# EAGLE design ft231x-breakout-v11-openSX70version (EAGLE 8.5.1)
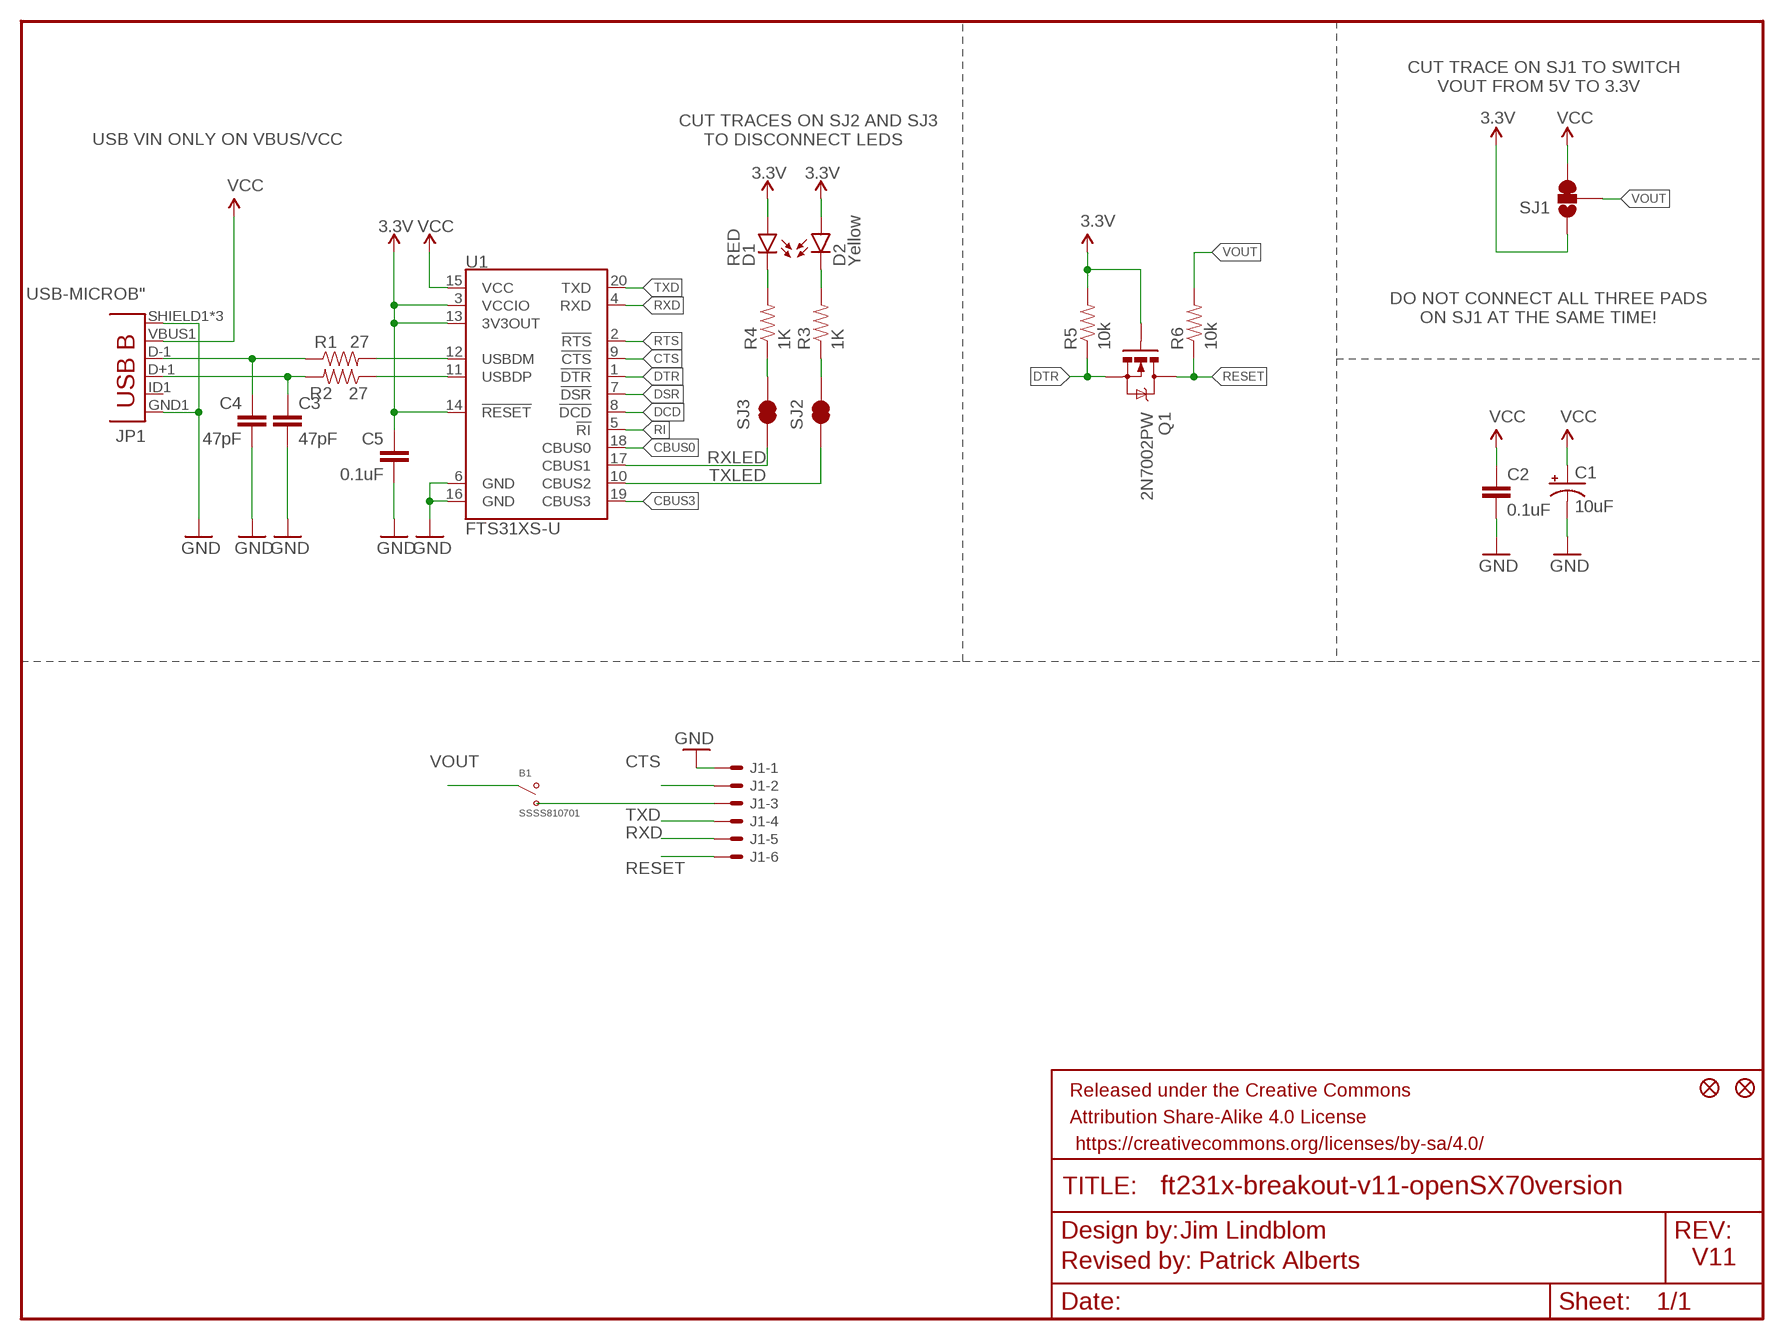
[diagram p0: schematic, sheet 1]

## Parts
B1  SSSS810701  [SSSS810701]
C1  10uF  10UF-16V-10%(TANT)  [EIA3216]
C2  0.1uF  0.1UF-25V(+80/-20%)(0603)  [0603-CAP]
C3  47pF  47PF-50V-5%(0603)  [0603-CAP]
C4  47pF  47PF-50V-5%(0603)  [0603-CAP]
C5  0.1uF  0.1UF-25V(+80/-20%)(0603)  [0603-CAP]
D1  RED  LED-RED0603  [LED-0603]
D2  Yellow  LED-YELLOW0603  [LED-0603]
FRAME1  FRAME-LETTER  [CREATIVE_COMMONS]
J1  XF2L-0625-1  [XF2L-0625-1]
JP1  USB-MICROB"  [USB-B-MICRO-SMD_V03]
JP5  FIDUCIAL1X2  [FIDUCIAL-1X2]
JP6  FIDUCIAL1X2  [FIDUCIAL-1X2]
Q1  2N7002PW  MOSFET-NCHANNEL2N7002PW  [SOT323]
R1  27  27OHM1/10W1%(0603)0603-RES  [0603-RES]
R2  27  27OHM1/10W1%(0603)0603-RES  [0603-RES]
R3  1K  1KOHM-1/10W-1%(0603)  [0603-RES]
R4  1K  1KOHM-1/10W-1%(0603)  [0603-RES]
R5  10k  10KOHM1/10W1%(0603)0603  [0603-RES@1]
R6  10k  10KOHM1/10W1%(0603)0603  [0603-RES@1]
SJ1  SOLDERJUMPER_2WAYS  [SJ_3]
SJ2  TXLED  SOLDERJUMPERTRACE  [SJ_2S-TRACE]
SJ3  RXLED  JUMPER-PAD-2-NC_BY_TRACE  [PAD-JUMPER-2-NC_BY_TRACE_YES_SILK]
U1  FTS31XS-U  FT231XS  [SSOP20_L]

## Nets
3.3V: C5.1 D1.A D2.A Q1.1(G) R5.2 SJ1.1 U1.3(VCCIO) U1.13(3V3OUT) U1.14(!RESET)
CBUS0: U1.18(CBUS0)
CBUS3: U1.19(CBUS3)
CTS: J1.2 U1.9(!CTS)
DCD: U1.8(!DCD)
DSR: U1.7(!DSR)
DTR: Q1.2(S) R5.1 U1.1(!DTR)
GND: C1.C(-) C2.2 C3.2 C4.2 C5.2 J1.1 JP1.GND1(GND) JP1.SHIELD1(SHIELD) JP1.SHIELD2(SHIELD) JP1.SHIELD3(SHIELD) U1.6(GND) U1.16(GND)
N$1: R1.2 U1.12(USBDM)
N$2: R2.1 U1.11(USBDP)
N$3: C3.1 JP1.D+1(D+) R2.2
N$4: C4.1 JP1.D-1(D-) R1.1
N$5: D2.C R3.2
N$6: D1.C R4.2
N$7: R3.1 SJ2.2
N$8: R4.1 SJ3.2
N$10: B1.1(B) J1.3
RESET: J1.6 Q1.3(D) R6.1
RI: U1.5(!RI)
RTS: U1.2(!RTS)
RXD: J1.5 U1.4(RXD)
RXLED: SJ3.1 U1.17(CBUS1)
TXD: J1.4 U1.20(TXD)
TXLED: SJ2.1 U1.10(CBUS2)
VCC: C1.A(+) C2.1 JP1.VBUS1(VBUS) SJ1.3 U1.15(VCC)
VOUT: B1.2(COM) R6.2 SJ1.2
Unconnected: B1.3(A) JP1.ID1(USBID)

## Notes on the sheet
- CUT TRACE ON SJ1 TO SWITCH
        VOUT FROM 5V TO 3.3V
- USB VIN ONLY ON VBUS/VCC
- CUT TRACES ON SJ2 AND SJ3 
       TO DISCONNECT LEDS
- DO NOT CONNECT ALL THREE PADS
        ON SJ1 AT THE SAME TIME!
- Jim Lindblom
- Revised by: Patrick Alberts | V11

## Library data of the parts
B1 = openSX70:SSSS810701; AVAILABILITY: Good; DESCRIPTION: Slide Switch • Rating (max.): 0.3 A 5 VDC • Poles: 1 • Positions: 2 • Travel : 1.5 mm • Operating direction: Horizontal; MF: ALPS; MP: SSSS810701; PACKAGE: None; PRICE: 0.53 USD
C1 = SparkFun-Capacitors:10UF-16V-10%(TANT): CAP-00811 1206/EIA-3216 Tantalum capacitor; PROD_ID: CAP-00811
C2 C5 = SparkFun-Capacitors:0.1UF-25V(+80/-20%)(0603): CAP-00810 Ceramic Standard decoupling cap; PROD_ID: CAP-00810
C3 C4 = SparkFun-Capacitors:47PF-50V-5%(0603): CAP-08913; PROD_ID: CAP-08913
D1 = SparkFun-LED:LED-RED: Assorted Red LEDs LilyPad 1206- DIO-09912 1206- DIO-00809 0603- DIO-00819 "SMART" means more efficient and expensive; PROD_ID: DIO-00819
D2 = SparkFun-LED:LED-YELLOW: Yellow SMD LEDs LilyPad 1206- DIO-09909 0603- DIO-09003 "SMART" means more efficient and expensive; PROD_ID: DIO-09003
FRAME1 = SparkFun-Aesthetics:FRAME-LETTER: Schematic Frame Standard 8.5x11 US Letter frame
J1 = con-omron:XF2*-06?: OMRON FPC Connector Source : http://www.omron.com/ecb/products/pdf/fpc.pdf; MF: OMRON COMPONENTS USA; MPN: XF2L-0625-1; OC_FARNELL: 1536105; OC_NEWARK: 29C7842
JP1 = SparkFun-Connectors:USB-MICROB; PROD_ID: CONN-11752
JP5 JP6 = SparkFun-Aesthetics:FIDUCIAL: Fiducial Alignment Points Various fiducial points for machine vision alignment.
Q1 = SparkFun-DiscreteSemi:MOSFET-NCHANNEL: Common NMOSFET Parts MFG P/N Store ID Prod ID FDD8780 TRANS-09984 SI7820DN TRANS-11055 FDS6630A IC-08089 2N7002PW TRANS-11151 FQP30N06L COM-10213 TRANS-10060 BSS123LT1G TRANS-08345 BSS138 TRANS-00830 BS170 2N7000; PROD_ID: TRANS-11151
R1 R2 = SparkFun-Resistors:27OHM1/10W1%(0603): RES-09334; PROD_ID: RES-09334
R3 R4 = SparkFun-Resistors:1KOHM-1/10W-1%(0603): RES-07856; PROD_ID: RES-07856
R5 R6 = SparkFun-Resistors:10KOHM1/10W1%(0603): RES-00824; PROD_ID: RES-00824; VALUE: 10K
SJ1 = SparkFun-Passives:SOLDERJUMPER_2WAY: Solder Jumper 2 way solder jumper
SJ2 = SparkFun-Passives:SOLDERJUMPER: Solder Jumper Standard SMD solder jumper. Used to automate production. Two varients : Normally Open and Normally Closed are the same, but have different paste layers. NC will have a large amount of paste and should jumper during reflow.
SJ3 = SparkFun-Passives:JUMPER-PAD-2-NC_BY_TRACE
U1 = SparkFun-DigitalIC:FT231X: FTDI FT231X Full Speed USB to Full-handshake UART This USB2.0 Full Speed IC offers a compact bridge to full handshake UART interfaces. The device is a UART, capable of operating up to 3MBaud, with low power consumption (8mA). The FT231X includes the complete FT-X series feature set and enables USB to be added into a system design quickly and easily over a UART interface.; PROD_ID: IC-11524

## Board
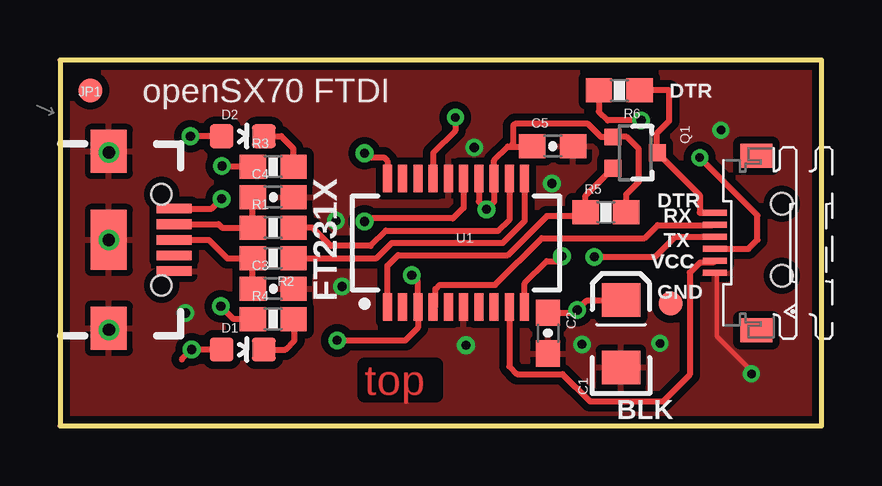
[diagram p1: board, top side]
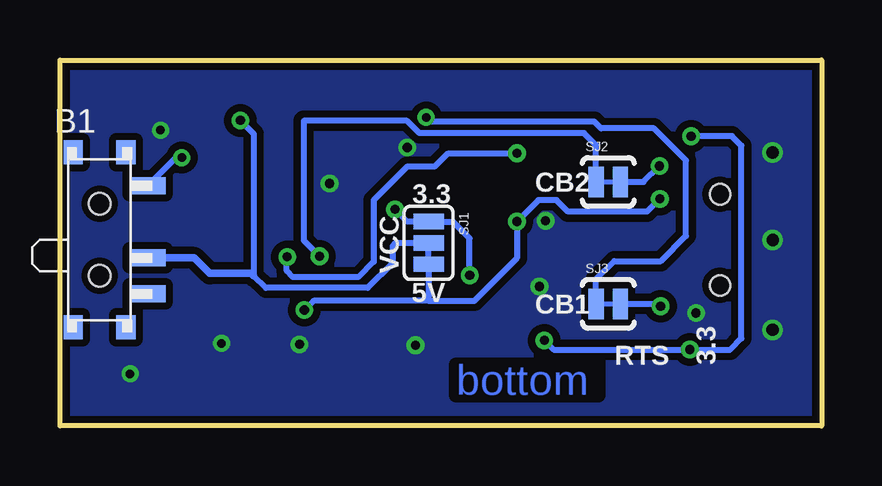
[diagram p2: board, bottom side, seen from below]

Size 31.75 x 15.24 mm. Coordinates in mm from the lower left corner, seen from the top.
Outline: 0,15.24 0,0 31.75,0 31.75,15.24 0,15.24
Copper layers (1*16): Top 0.035mm / dielectric 1.5mm / Bottom 0.035mm
Design rules "SparkFun-2-layer-TIGHT": minimum track width 7mil, minimum drill 15mil, track to track 7mil, track to pad 7mil, pad to pad 7mil, via to via 7mil, smd to smd 7mil, copper to edge 7mil, drill to drill 7mil, minimum pad ring 7mil, minimum via ring 7mil, stop-mask expansion 4mil, vias tented up to drill 20mil, thermal gap 10mil

### Footprints (pad centres in the part's own frame; a part is rotated, then mirrored left to right if it is on the bottom)
SSSS810701 = smd 0.7 x 1.5: 1 -2.25,2; 2 0.75,2; 3 2.25,2 | smd 1 x 0.8: 4.1 -3.65,1.1; 4.2 3.65,1.1; 4.3 -3.65,-1.1; 4.4 3.65,-1.1 | hole 0.9: 1.5,0; -1.5,0
EIA3216 = smd 1.4 x 1.6: A 1.4,0; C -1.4,0
0603-CAP = smd 1.1 x 1: 1 -0.85,0; 2 0.85,0
LED-0603 = smd 1 x 1: A 0,-0.877; C 0,0.877
XF2L-0625-1 = smd 1 x 0.25: 1 1.905,1.25; 2 1.905,0.75; 3 1.905,0.25; 4 1.905,-0.25; 5 1.905,-0.75; 6 1.905,-1.25 | smd 1.34 x 1: M1 0.18,3.638; M2 0.18,-3.638
USB-B-MICRO-SMD_V03 = smd 1.45 x 0.4: D+1 2.725,0; D-1 2.725,0.65; GND1 2.725,-1.3; ID1 2.725,-0.65; VBUS1 2.725,1.3 | smd 1.5 x 1.8: SHIELD1 0,3.685; SHIELD2 0,-3.685 | smd 1.5 x 2.5: SHIELD3 0,0 | hole 0.85: 2.2,1.9; 2.2,-1.9
FIDUCIAL-1X2 = smd 1 x 1: 1 0,0
SOT323 = smd 0.7 x 0.7: 1 -0.65,-0.925; 2 0.65,-0.925; 3 0,0.925
0603-RES = smd 1.1 x 1: 1 -0.85,0; 2 0.85,0
0603-RES@1 = smd 1.1 x 1: 1 -0.85,0; 2 0.85,0
SJ_3 = smd 0.635 x 1.27: 1 -0.889,0; 2 0,0; 3 0.889,0
SJ_2S-TRACE = smd 0.635 x 1.27: 1 -0.508,0; 2 0.508,0
PAD-JUMPER-2-NC_BY_TRACE_YES_SILK = smd 0.635 x 1.27: 1 -0.508,0; 2 0.508,0
SSOP20_L = smd 0.381 x 1.143: 1 -2.857,-2.68; 2 -2.223,-2.68; 3 -1.587,-2.68; 4 -0.953,-2.68; 5 -0.318,-2.68; 6 0.318,-2.68; 7 0.953,-2.68; 8 1.587,-2.68; 9 2.223,-2.68; 10 2.857,-2.68; 11 2.857,2.68; 12 2.223,2.68; 13 1.587,2.68; 14 0.953,2.68; 15 0.318,2.68; 16 -0.318,2.68; 17 -0.953,2.68; 18 -1.587,2.68; 19 -2.223,2.68; 20 -2.857,2.68

### Placement (x,y rotation side)
B1  30.1,7.75 270 bottom
C1  23.39,3.84 90 top
C2  20.35,3.86 270 top
C3  8.89,5.71 0 top
C4  8.89,9.53 0 top
C5  20.54,11.65 0 top
D1  7.62,3.17 270 top
D2  7.62,12.06 270 top
FRAME1  -10.16,-11.43 0 top  (outside the outline)
J1  29.21,7.62 180 top
JP1  2.03,7.75 0 top
JP5  25.45,5.09 0 top
JP6  1.27,13.97 0 top
Q1  23.98,11.38 270 top
R1  8.89,8.26 0 top
R2  8.89,6.99 180 top
R3  8.89,10.79 0 top
R4  8.89,4.45 0 top
R5  22.76,8.89 0 top
R6  23.32,13.97 180 top
SJ1  16.38,7.62 270 bottom
SJ2  8.89,10.16 0 bottom
SJ3  8.89,5.08 0 bottom
U1  16.51,7.62 0 top

### Tracks (layer width: path | path; a pad name or v marks a point on that pad's centre or on a via)
3.3V  (via drill 0.38)
  Top 0.254: U1.14 17.46,9.34 v17.78,9.02 18.1,9.34 U1.13 18.1,11.06 18.67,11.63 18.78,11.63 | v11.56,3.56 14.4,3.56 14.92,4.08 U1.3 14.92,6.02 v14.67,6.27 | D2.A v5.44,12.06 | D1.A v5.49,3.17 5.08,2.77 | R5.2 23.61,9.64 24.13,10.16 24.13,11.54 23.64,12.03 Q1.1 22.57,12.03 22.21,12.39 | C5.1 19.68,11.63 18.78,11.63 | 22.21,12.39 | 22.21,12.39 22.02,12.58 18.98,12.58 18.89,12.5 18.89,11.75 18.78,11.63
  Bottom 0.254: v17.78,9.02 17.27,8.51 SJ1.1 15.37,8.51 14.67,7.81 v14.67,6.27 | v11.56,3.56 11.18,3.17 v5.49,3.17 3.81,3.17 3.34,3.64 3.34,11.67 3.74,12.06 v5.44,12.06
CTS
  Top 0.254: U1.9 18.73,2.48 19.05,2.16 20.96,2.16 22.1,1.02 25.15,1.02 26.26,2.13 26.26,6.38 26.68,6.8 27.23,6.8 J1.2
DTR
  Top 0.254: U1.1 13.65,6.67 14.1,7.11 18.67,7.11 20.3,8.74 21.44,8.74 21.59,8.89 R5.1 21.91,9.59 Q1.2
GND  (via drill 0.35, 0.38, 0.51)
  Top 0.178: J1.1 27.38,6.4 27.38,3.73 28.8,2.31 v28.83,2.16
  other vias: 17.27,11.6 16.93,3.35 11.76,5.8 5.23,4.7 20.51,10.1 21.77,3.39 11.5,8.54 2.04,7.74 2.04,4 2.04,11.38 25.02,3.43 27.56,12.32
  pour Top (isolate 0.305): 0,15.24 0,0 31.75,0 31.75,15.24
  pour Bottom (isolate 0.305): 0,15.24 0,0 31.75,0 31.75,15.24
N$1
  Top 0.254: U1.12 18.73,8.57 18.29,8.13 13.59,8.13 12.95,7.49 11.29,7.49 10.53,8.26 R1.2 | R1.2 9.91,8.26 | 9.77,8.23 R1.2
N$2
  Top 0.254: U1.11 19.37,8.52 18.47,7.62 13.84,7.62 13.21,6.99 R2.1
N$3
  Top 0.254: C3.1 R2.2 8.03,6.98 6.97,6.98 6.2,7.75 JP1.D+1
N$4
  Top 0.254: C4.1 R1.1 6.76,8.26 6.61,8.4 JP1.D-1
N$5
  Top 0.254: D2.C 9.22,12.06 9.73,11.56 9.73,10.81 R3.2
N$6
  Top 0.254: 9.64,4.34 R4.2 9.78,4.41 9.78,3.56 9.4,3.17 D1.C
N$7  (via drill 0.38)
  Top 0.254: v6.76,10.82 8.02,10.82 R3.1
  Bottom 0.254: SJ2.2 7.42,10.16 v6.76,10.82
N$8  (via drill 0.38)
  Top 0.254: R4.1 7.24,4.45 v6.71,4.98
  Bottom 0.254: SJ3.2 6.81,5.08 v6.71,4.98
N$9
  Bottom 0.254: 16.38,6.73 16.38,7.49
N$10  (via drill 0.35)
  Top 0.254: J1.3 28.71,7.37 29.08,7.75 29.08,8.76 v26.67,11.18
  Bottom 0.254: v26.67,11.18 26.92,11.18 B1.1
RESET
  Top 0.254: R6.1 25.4,13.97 25.4,12.7 24.89,12.19 Q1.3 26.67,9.61 26.67,8.89 26.69,8.87 J1.6
RXD
  Top 0.178: 27.2,8.36 J1.5 | 15.65,4.98 U1.4
  Top 0.254: 27.2,8.36 24.92,8.36 24.38,7.82 20.09,7.82 18.14,5.87 15.82,5.87 15.65,5.69 15.65,4.98
RXLED  (via drill 0.35)
  Top 0.254: v16.48,12.85 16.48,12.29 15.56,11.37 U1.17
  Bottom 0.254: SJ3.1 9.4,6.1 8.64,6.86 6.7,6.86 5.65,7.91 5.65,11.06 6.99,12.39 9.2,12.39 9.47,12.68 16.48,12.68 v16.48,12.85
TXD  (via drill 0.38)
  Top 0.254: v22.28,7.04 24.82,7.04 25.65,7.87 25.66,7.87 J1.4 | U1.20 13.65,11.03 13.5,11.19 12.87,11.19 v12.7,11.35 12.7,11.43
  Bottom 0.254: v22.28,7.04 22.3,7.01 22.3,6.45 22.05,6.2 19.3,6.2 18.67,6.83 18.67,9.4 17.27,10.79 16.13,10.79 15.57,11.35 v12.7,11.35
TXLED  (via drill 0.38)
  Top 0.254: U1.10 19.37,5.93 20.29,6.86 20.72,6.86 v20.93,7.06
  Bottom 0.254: SJ2.1 9.4,11.68 9.91,12.19 16.76,12.19 17.27,12.7 21.59,12.7 21.59,7.72 v20.93,7.06
VCC  (via drill 0.38)
  Top 0.254: U1.15 16.83,9.08 16.38,8.64 12.83,8.64 v12.7,8.51 | C1.A 23.36,5.21 21.95,5.21 v21.57,4.83 21.45,4.71 C2.1 | JP1.VBUS1 6.33,9.05 v6.74,9.45
  Bottom 0.254: 16.38,5.21 14.48,5.21 12.7,6.99 v12.7,8.51 11.81,9.4 11.05,9.4 10.57,8.92 7.27,8.92 v6.74,9.45 | SJ1.3 16.38,5.21 | 16.38,5.21 21.18,5.21 v21.57,4.83
VOUT  (via drill 0.38)
  Top 0.254: R6.2 22.47,13.09 22.84,12.72 v24.23,12.72
  Bottom 0.254: SJ1.2 17.75,7.62 17.87,7.5 17.87,6.79 18.92,5.74 23.16,5.74 23.67,6.25 23.67,12.17 v24.23,12.72
  Bottom 0.305: B1.2 26.15,7 25.5,6.35 23.77,6.35 23.67,6.25

### Text on the board
Top: top
Bottom: bottom
tPlace: DTR | openSX70 FTDI | DTR | RX | FT231X | TX | VCC | VCC | GND | BLK
bPlace: CB2 | 3.3 | 5V | VCC | CB1 | 3.3 | RTS
tDocu: J. Lindblom | Revised by: Patrick Alberts